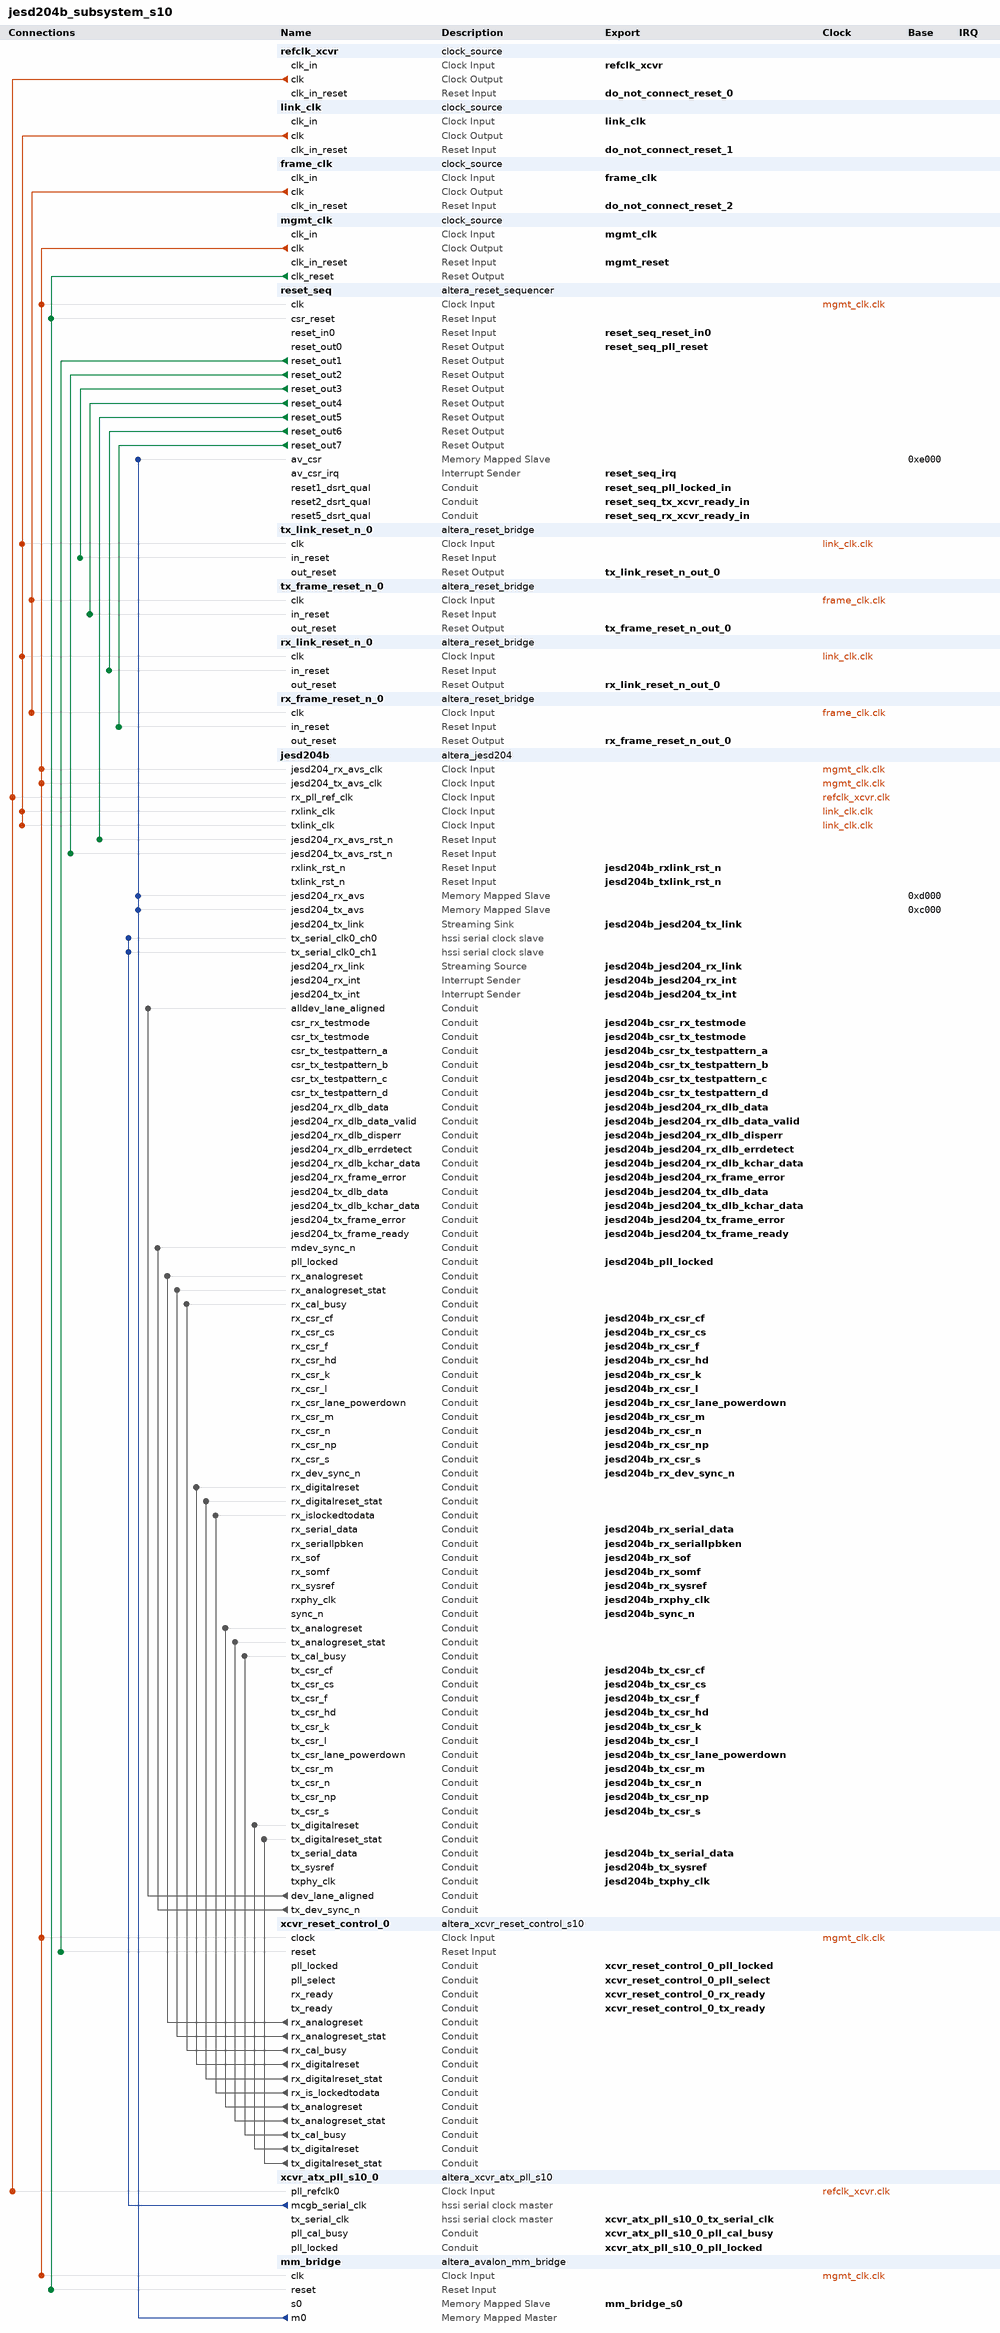
[diagram p0: system contents]
# Platform Designer (Qsys) system jesd204b_subsystem_s10, Stratix 10 1SG280LN3F43E1VG
# Parameters at their usual value, and those the tool derives, are not listed.
package require -exact qsys 1.0
create_system jesd204b_subsystem_s10
set_project_property DEVICE_FAMILY {Stratix 10}
set_project_property DEVICE 1SG280LN3F43E1VG

add_component refclk_xcvr ip/jesd204b_subsystem/jesd204b_subsystem_clk_0.ip clock_source refclk_xcvr 0

add_component link_clk ip/jesd204b_subsystem/jesd204b_subsystem_clk_1.ip clock_source link_clk 

add_component frame_clk ip/jesd204b_subsystem/jesd204b_subsystem_clk_2.ip clock_source frame_clk 

add_component mgmt_clk ip/jesd204b_subsystem/jesd204b_subsystem_clk_3.ip clock_source mgmt_clk 

add_component reset_seq ip/jesd204b_subsystem/jesd204b_subsystem_reset_sequencer_0.ip altera_reset_sequencer reset_seq 16.1

add_component tx_link_reset_n_0 ip/jesd204b_subsystem/jesd204b_subsystem_reset_bridge_0.ip altera_reset_bridge tx_link_reset_n_0 16.1

add_component tx_frame_reset_n_0 ip/jesd204b_subsystem/jesd204b_subsystem_reset_bridge_1.ip altera_reset_bridge tx_frame_reset_n_0 16.1

add_component rx_link_reset_n_0 ip/jesd204b_subsystem/jesd204b_subsystem_reset_bridge_2.ip altera_reset_bridge rx_link_reset_n_0 16.1

add_component rx_frame_reset_n_0 ip/jesd204b_subsystem/jesd204b_subsystem_reset_bridge_3.ip altera_reset_bridge rx_frame_reset_n_0 16.1

add_component jesd204b ip/jesd204b_subsystem/jesd204b_subsystem_jesd204_0.ip altera_jesd204 jesd204b 16.1

add_component xcvr_reset_control_0 ip/jesd204b_subsystem/jesd204b_subsystem_xcvr_reset_control_s10_0.ip altera_xcvr_reset_control_s10 xcvr_reset_control_0 16.1

add_component xcvr_atx_pll_s10_0 ip/jesd204b_subsystem/jesd204b_subsystem_xcvr_atx_pll_s10_0.ip altera_xcvr_atx_pll_s10 xcvr_atx_pll_s10_0 16.1

add_component mm_bridge ip/jesd204b_subsystem/jesd204b_subsystem_mm_bridge_0.ip altera_avalon_mm_bridge mm_bridge 16.1

# connections
add_connection frame_clk.clk rx_frame_reset_n_0.clk clock
add_connection frame_clk.clk tx_frame_reset_n_0.clk clock
add_connection link_clk.clk jesd204b.rxlink_clk clock
add_connection link_clk.clk jesd204b.txlink_clk clock
add_connection link_clk.clk rx_link_reset_n_0.clk clock
add_connection link_clk.clk tx_link_reset_n_0.clk clock
add_connection mgmt_clk.clk jesd204b.jesd204_rx_avs_clk clock
add_connection mgmt_clk.clk jesd204b.jesd204_tx_avs_clk clock
add_connection mgmt_clk.clk mm_bridge.clk clock
add_connection mgmt_clk.clk reset_seq.clk clock
add_connection mgmt_clk.clk xcvr_reset_control_0.clock clock
add_connection refclk_xcvr.clk jesd204b.rx_pll_ref_clk clock
add_connection refclk_xcvr.clk xcvr_atx_pll_s10_0.pll_refclk0 clock
add_connection mgmt_clk.clk_reset mm_bridge.reset reset
add_connection mgmt_clk.clk_reset reset_seq.csr_reset reset
add_connection reset_seq.reset_out1 xcvr_reset_control_0.reset reset
add_connection reset_seq.reset_out2 jesd204b.jesd204_tx_avs_rst_n reset
add_connection reset_seq.reset_out3 tx_link_reset_n_0.in_reset reset
add_connection reset_seq.reset_out4 tx_frame_reset_n_0.in_reset reset
add_connection reset_seq.reset_out5 jesd204b.jesd204_rx_avs_rst_n reset
add_connection reset_seq.reset_out6 rx_link_reset_n_0.in_reset reset
add_connection reset_seq.reset_out7 rx_frame_reset_n_0.in_reset reset
add_connection mm_bridge.m0 jesd204b.jesd204_rx_avs avalon
set_connection_parameter_value mm_bridge.m0/jesd204b.jesd204_rx_avs baseAddress 0xd000
add_connection mm_bridge.m0 jesd204b.jesd204_tx_avs avalon
set_connection_parameter_value mm_bridge.m0/jesd204b.jesd204_tx_avs baseAddress 0xc000
add_connection mm_bridge.m0 reset_seq.av_csr avalon
set_connection_parameter_value mm_bridge.m0/reset_seq.av_csr baseAddress 0xe000
add_connection jesd204b.dev_lane_aligned jesd204b.alldev_lane_aligned conduit
add_connection jesd204b.tx_dev_sync_n jesd204b.mdev_sync_n conduit
add_connection xcvr_reset_control_0.rx_analogreset jesd204b.rx_analogreset conduit
add_connection xcvr_reset_control_0.rx_analogreset_stat jesd204b.rx_analogreset_stat conduit
add_connection xcvr_reset_control_0.rx_cal_busy jesd204b.rx_cal_busy conduit
add_connection xcvr_reset_control_0.rx_digitalreset jesd204b.rx_digitalreset conduit
add_connection xcvr_reset_control_0.rx_digitalreset_stat jesd204b.rx_digitalreset_stat conduit
add_connection xcvr_reset_control_0.rx_is_lockedtodata jesd204b.rx_islockedtodata conduit
add_connection xcvr_reset_control_0.tx_analogreset jesd204b.tx_analogreset conduit
add_connection xcvr_reset_control_0.tx_analogreset_stat jesd204b.tx_analogreset_stat conduit
add_connection xcvr_reset_control_0.tx_cal_busy jesd204b.tx_cal_busy conduit
add_connection xcvr_reset_control_0.tx_digitalreset jesd204b.tx_digitalreset conduit
add_connection xcvr_reset_control_0.tx_digitalreset_stat jesd204b.tx_digitalreset_stat conduit
add_connection xcvr_atx_pll_s10_0.mcgb_serial_clk jesd204b.tx_serial_clk0_ch0 hssi_serial_clock
add_connection xcvr_atx_pll_s10_0.mcgb_serial_clk jesd204b.tx_serial_clk0_ch1 hssi_serial_clock

# exported interfaces
add_interface do_not_connect_reset_0 reset sink
set_interface_property do_not_connect_reset_0 EXPORT_OF refclk_xcvr.clk_in_reset
add_interface do_not_connect_reset_1 reset sink
set_interface_property do_not_connect_reset_1 EXPORT_OF link_clk.clk_in_reset
add_interface do_not_connect_reset_2 reset sink
set_interface_property do_not_connect_reset_2 EXPORT_OF frame_clk.clk_in_reset
add_interface frame_clk clock sink
set_interface_property frame_clk EXPORT_OF frame_clk.clk_in
add_interface jesd204b_csr_rx_testmode conduit end
set_interface_property jesd204b_csr_rx_testmode EXPORT_OF jesd204b.csr_rx_testmode
add_interface jesd204b_csr_tx_testmode conduit end
set_interface_property jesd204b_csr_tx_testmode EXPORT_OF jesd204b.csr_tx_testmode
add_interface jesd204b_csr_tx_testpattern_a conduit end
set_interface_property jesd204b_csr_tx_testpattern_a EXPORT_OF jesd204b.csr_tx_testpattern_a
add_interface jesd204b_csr_tx_testpattern_b conduit end
set_interface_property jesd204b_csr_tx_testpattern_b EXPORT_OF jesd204b.csr_tx_testpattern_b
add_interface jesd204b_csr_tx_testpattern_c conduit end
set_interface_property jesd204b_csr_tx_testpattern_c EXPORT_OF jesd204b.csr_tx_testpattern_c
add_interface jesd204b_csr_tx_testpattern_d conduit end
set_interface_property jesd204b_csr_tx_testpattern_d EXPORT_OF jesd204b.csr_tx_testpattern_d
add_interface jesd204b_jesd204_rx_dlb_data conduit end
set_interface_property jesd204b_jesd204_rx_dlb_data EXPORT_OF jesd204b.jesd204_rx_dlb_data
add_interface jesd204b_jesd204_rx_dlb_data_valid conduit end
set_interface_property jesd204b_jesd204_rx_dlb_data_valid EXPORT_OF jesd204b.jesd204_rx_dlb_data_valid
add_interface jesd204b_jesd204_rx_dlb_disperr conduit end
set_interface_property jesd204b_jesd204_rx_dlb_disperr EXPORT_OF jesd204b.jesd204_rx_dlb_disperr
add_interface jesd204b_jesd204_rx_dlb_errdetect conduit end
set_interface_property jesd204b_jesd204_rx_dlb_errdetect EXPORT_OF jesd204b.jesd204_rx_dlb_errdetect
add_interface jesd204b_jesd204_rx_dlb_kchar_data conduit end
set_interface_property jesd204b_jesd204_rx_dlb_kchar_data EXPORT_OF jesd204b.jesd204_rx_dlb_kchar_data
add_interface jesd204b_jesd204_rx_frame_error conduit end
set_interface_property jesd204b_jesd204_rx_frame_error EXPORT_OF jesd204b.jesd204_rx_frame_error
add_interface jesd204b_jesd204_rx_int interrupt sender
set_interface_property jesd204b_jesd204_rx_int EXPORT_OF jesd204b.jesd204_rx_int
add_interface jesd204b_jesd204_rx_link avalon_streaming source
set_interface_property jesd204b_jesd204_rx_link EXPORT_OF jesd204b.jesd204_rx_link
add_interface jesd204b_jesd204_tx_dlb_data conduit end
set_interface_property jesd204b_jesd204_tx_dlb_data EXPORT_OF jesd204b.jesd204_tx_dlb_data
add_interface jesd204b_jesd204_tx_dlb_kchar_data conduit end
set_interface_property jesd204b_jesd204_tx_dlb_kchar_data EXPORT_OF jesd204b.jesd204_tx_dlb_kchar_data
add_interface jesd204b_jesd204_tx_frame_error conduit end
set_interface_property jesd204b_jesd204_tx_frame_error EXPORT_OF jesd204b.jesd204_tx_frame_error
add_interface jesd204b_jesd204_tx_frame_ready conduit end
set_interface_property jesd204b_jesd204_tx_frame_ready EXPORT_OF jesd204b.jesd204_tx_frame_ready
add_interface jesd204b_jesd204_tx_int interrupt sender
set_interface_property jesd204b_jesd204_tx_int EXPORT_OF jesd204b.jesd204_tx_int
add_interface jesd204b_jesd204_tx_link avalon_streaming sink
set_interface_property jesd204b_jesd204_tx_link EXPORT_OF jesd204b.jesd204_tx_link
add_interface jesd204b_pll_locked conduit end
set_interface_property jesd204b_pll_locked EXPORT_OF jesd204b.pll_locked
add_interface jesd204b_rx_csr_cf conduit end
set_interface_property jesd204b_rx_csr_cf EXPORT_OF jesd204b.rx_csr_cf
add_interface jesd204b_rx_csr_cs conduit end
set_interface_property jesd204b_rx_csr_cs EXPORT_OF jesd204b.rx_csr_cs
add_interface jesd204b_rx_csr_f conduit end
set_interface_property jesd204b_rx_csr_f EXPORT_OF jesd204b.rx_csr_f
add_interface jesd204b_rx_csr_hd conduit end
set_interface_property jesd204b_rx_csr_hd EXPORT_OF jesd204b.rx_csr_hd
add_interface jesd204b_rx_csr_k conduit end
set_interface_property jesd204b_rx_csr_k EXPORT_OF jesd204b.rx_csr_k
add_interface jesd204b_rx_csr_l conduit end
set_interface_property jesd204b_rx_csr_l EXPORT_OF jesd204b.rx_csr_l
add_interface jesd204b_rx_csr_lane_powerdown conduit end
set_interface_property jesd204b_rx_csr_lane_powerdown EXPORT_OF jesd204b.rx_csr_lane_powerdown
add_interface jesd204b_rx_csr_m conduit end
set_interface_property jesd204b_rx_csr_m EXPORT_OF jesd204b.rx_csr_m
add_interface jesd204b_rx_csr_n conduit end
set_interface_property jesd204b_rx_csr_n EXPORT_OF jesd204b.rx_csr_n
add_interface jesd204b_rx_csr_np conduit end
set_interface_property jesd204b_rx_csr_np EXPORT_OF jesd204b.rx_csr_np
add_interface jesd204b_rx_csr_s conduit end
set_interface_property jesd204b_rx_csr_s EXPORT_OF jesd204b.rx_csr_s
add_interface jesd204b_rx_dev_sync_n conduit end
set_interface_property jesd204b_rx_dev_sync_n EXPORT_OF jesd204b.rx_dev_sync_n
add_interface jesd204b_rx_serial_data conduit end
set_interface_property jesd204b_rx_serial_data EXPORT_OF jesd204b.rx_serial_data
add_interface jesd204b_rx_seriallpbken conduit end
set_interface_property jesd204b_rx_seriallpbken EXPORT_OF jesd204b.rx_seriallpbken
add_interface jesd204b_rx_sof conduit end
set_interface_property jesd204b_rx_sof EXPORT_OF jesd204b.rx_sof
add_interface jesd204b_rx_somf conduit end
set_interface_property jesd204b_rx_somf EXPORT_OF jesd204b.rx_somf
add_interface jesd204b_rx_sysref conduit end
set_interface_property jesd204b_rx_sysref EXPORT_OF jesd204b.rx_sysref
add_interface jesd204b_rxlink_rst_n reset sink
set_interface_property jesd204b_rxlink_rst_n EXPORT_OF jesd204b.rxlink_rst_n
add_interface jesd204b_rxphy_clk conduit end
set_interface_property jesd204b_rxphy_clk EXPORT_OF jesd204b.rxphy_clk
add_interface jesd204b_sync_n conduit end
set_interface_property jesd204b_sync_n EXPORT_OF jesd204b.sync_n
add_interface jesd204b_tx_csr_cf conduit end
set_interface_property jesd204b_tx_csr_cf EXPORT_OF jesd204b.tx_csr_cf
add_interface jesd204b_tx_csr_cs conduit end
set_interface_property jesd204b_tx_csr_cs EXPORT_OF jesd204b.tx_csr_cs
add_interface jesd204b_tx_csr_f conduit end
set_interface_property jesd204b_tx_csr_f EXPORT_OF jesd204b.tx_csr_f
add_interface jesd204b_tx_csr_hd conduit end
set_interface_property jesd204b_tx_csr_hd EXPORT_OF jesd204b.tx_csr_hd
add_interface jesd204b_tx_csr_k conduit end
set_interface_property jesd204b_tx_csr_k EXPORT_OF jesd204b.tx_csr_k
add_interface jesd204b_tx_csr_l conduit end
set_interface_property jesd204b_tx_csr_l EXPORT_OF jesd204b.tx_csr_l
add_interface jesd204b_tx_csr_lane_powerdown conduit end
set_interface_property jesd204b_tx_csr_lane_powerdown EXPORT_OF jesd204b.tx_csr_lane_powerdown
add_interface jesd204b_tx_csr_m conduit end
set_interface_property jesd204b_tx_csr_m EXPORT_OF jesd204b.tx_csr_m
add_interface jesd204b_tx_csr_n conduit end
set_interface_property jesd204b_tx_csr_n EXPORT_OF jesd204b.tx_csr_n
add_interface jesd204b_tx_csr_np conduit end
set_interface_property jesd204b_tx_csr_np EXPORT_OF jesd204b.tx_csr_np
add_interface jesd204b_tx_csr_s conduit end
set_interface_property jesd204b_tx_csr_s EXPORT_OF jesd204b.tx_csr_s
add_interface jesd204b_tx_serial_data conduit end
set_interface_property jesd204b_tx_serial_data EXPORT_OF jesd204b.tx_serial_data
add_interface jesd204b_tx_sysref conduit end
set_interface_property jesd204b_tx_sysref EXPORT_OF jesd204b.tx_sysref
add_interface jesd204b_txlink_rst_n reset sink
set_interface_property jesd204b_txlink_rst_n EXPORT_OF jesd204b.txlink_rst_n
add_interface jesd204b_txphy_clk conduit end
set_interface_property jesd204b_txphy_clk EXPORT_OF jesd204b.txphy_clk
add_interface link_clk clock sink
set_interface_property link_clk EXPORT_OF link_clk.clk_in
add_interface mgmt_clk clock sink
set_interface_property mgmt_clk EXPORT_OF mgmt_clk.clk_in
add_interface mgmt_reset reset sink
set_interface_property mgmt_reset EXPORT_OF mgmt_clk.clk_in_reset
add_interface mm_bridge_s0 avalon slave
set_interface_property mm_bridge_s0 EXPORT_OF mm_bridge.s0
add_interface refclk_xcvr clock sink
set_interface_property refclk_xcvr EXPORT_OF refclk_xcvr.clk_in
add_interface reset_seq_irq interrupt sender
set_interface_property reset_seq_irq EXPORT_OF reset_seq.av_csr_irq
add_interface reset_seq_pll_locked_in conduit end
set_interface_property reset_seq_pll_locked_in EXPORT_OF reset_seq.reset1_dsrt_qual
add_interface reset_seq_pll_reset reset source
set_interface_property reset_seq_pll_reset EXPORT_OF reset_seq.reset_out0
add_interface reset_seq_reset_in0 reset sink
set_interface_property reset_seq_reset_in0 EXPORT_OF reset_seq.reset_in0
add_interface reset_seq_rx_xcvr_ready_in conduit end
set_interface_property reset_seq_rx_xcvr_ready_in EXPORT_OF reset_seq.reset5_dsrt_qual
add_interface reset_seq_tx_xcvr_ready_in conduit end
set_interface_property reset_seq_tx_xcvr_ready_in EXPORT_OF reset_seq.reset2_dsrt_qual
add_interface rx_frame_reset_n_out_0 reset source
set_interface_property rx_frame_reset_n_out_0 EXPORT_OF rx_frame_reset_n_0.out_reset
add_interface rx_link_reset_n_out_0 reset source
set_interface_property rx_link_reset_n_out_0 EXPORT_OF rx_link_reset_n_0.out_reset
add_interface tx_frame_reset_n_out_0 reset source
set_interface_property tx_frame_reset_n_out_0 EXPORT_OF tx_frame_reset_n_0.out_reset
add_interface tx_link_reset_n_out_0 reset source
set_interface_property tx_link_reset_n_out_0 EXPORT_OF tx_link_reset_n_0.out_reset
add_interface xcvr_atx_pll_s10_0_pll_cal_busy conduit end
set_interface_property xcvr_atx_pll_s10_0_pll_cal_busy EXPORT_OF xcvr_atx_pll_s10_0.pll_cal_busy
add_interface xcvr_atx_pll_s10_0_pll_locked conduit end
set_interface_property xcvr_atx_pll_s10_0_pll_locked EXPORT_OF xcvr_atx_pll_s10_0.pll_locked
add_interface xcvr_atx_pll_s10_0_tx_serial_clk hssi_serial_clock start
set_interface_property xcvr_atx_pll_s10_0_tx_serial_clk EXPORT_OF xcvr_atx_pll_s10_0.tx_serial_clk
add_interface xcvr_reset_control_0_pll_locked conduit end
set_interface_property xcvr_reset_control_0_pll_locked EXPORT_OF xcvr_reset_control_0.pll_locked
add_interface xcvr_reset_control_0_pll_select conduit end
set_interface_property xcvr_reset_control_0_pll_select EXPORT_OF xcvr_reset_control_0.pll_select
add_interface xcvr_reset_control_0_rx_ready conduit end
set_interface_property xcvr_reset_control_0_rx_ready EXPORT_OF xcvr_reset_control_0.rx_ready
add_interface xcvr_reset_control_0_tx_ready conduit end
set_interface_property xcvr_reset_control_0_tx_ready EXPORT_OF xcvr_reset_control_0.tx_ready

set_interconnect_requirement {$system} qsys_mm.clockCrossingAdapter HANDSHAKE
set_interconnect_requirement {$system} qsys_mm.enableEccProtection FALSE
set_interconnect_requirement {$system} qsys_mm.insertDefaultSlave FALSE
set_interconnect_requirement {$system} qsys_mm.maxAdditionalLatency 1

save_system jesd204b_subsystem_s10.qsys
